# Altium schematic sheet LTC2194_4.SchDoc
size A; SheetNumber: 9; SheetTotal: 24
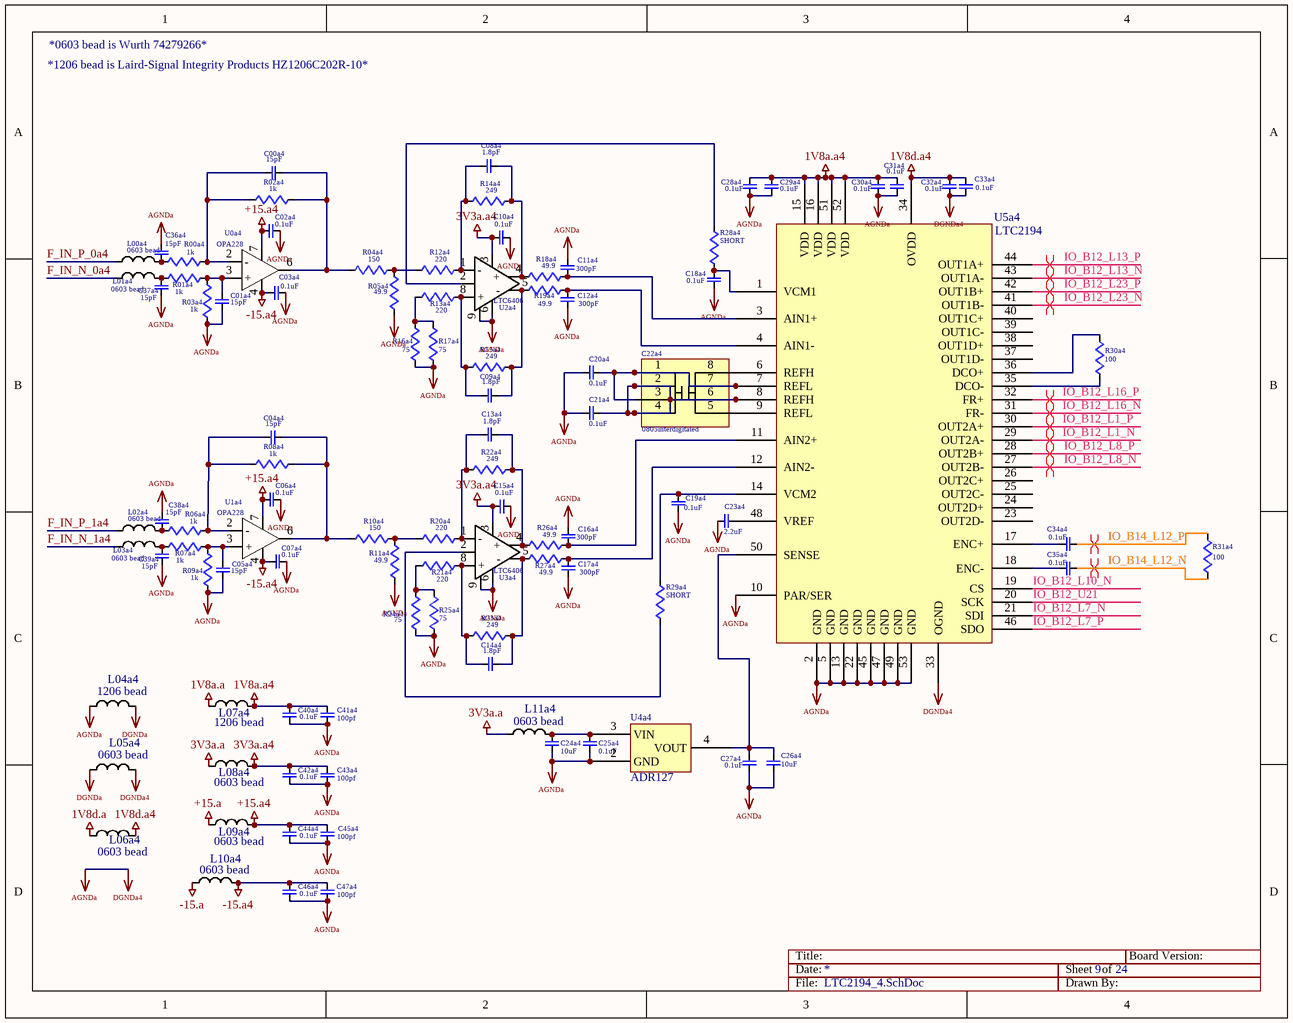
[diagram p0: LTC2194_4.SchDoc]

## Parts
C00a4  15pF  [0603]
C01a4  15pF  [0603]
C02a4  0.1uF  [0603]
C03a4  0.1uF  [0603]
C04a4  15pF  [0603]
C05a4  15pF  [0603]
C06a4  0.1uF  [0603]
C07a4  0.1uF  [0603]
C08a4  1.8pF  [0603]
C09a4  1.8pF  [0603]
C10a4  0.1uF  [0603]
C11a4  300pF  [0603]
C12a4  300pF  [0603]
C13a4  1.8pF  [0603]
C14a4  1.8pF  [0603]
C15a4  0.1uF  [0603]
C16a4  300pF  [0603]
C17a4  300pF  [0603]
C18a4  0.1uF  [0402]
C19a4  0.1uF  [0402]
C20a4  0.1uF  [0402]
C21a4  0.1uF  [0402]
C22a4  0805interdigitated  [0805int]
C23a4  2.2uF  [0402]
C24a4  10uF  [0603]
C25a4  0.1uF  [0603]
C26a4  10uF  [0603]
C27a4  0.1uF  [0603]
C28a4  0.1uF  [0402]
C29a4  0.1uF  [0402]
C30a4  0.1uF  [0402]
C31a4  0.1uF  [0402]
C32a4  0.1uF  [0402]
C33a4  0.1uF  [0402]
C34a4  0.1uF  [0402]
C35a4  0.1uF  [0402]
C36a4  15pF  [0603]
C37a4  15pF  [0603]
C38a4  15pF  [0603]
C39a4  15pF  [0603]
C40a4  0.1uF  [0603]
C41a4  100pf  [0603]
C42a4  0.1uF  [0603]
C43a4  100pf  [0603]
C44a4  0.1uF  [0603]
C45a4  100pf  [0603]
C46a4  0.1uF  [0603]
C47a4  100pf  [0603]
L00a4  0603 bead  [0603]
L01a4  0603 bead  [0603]
L02a4  0603 bead  [0603]
L03a4  0603 bead  [0603]
L04a4  1206 bead  [1206]
L05a4  0603 bead  [0603]
L06a4  0603 bead  [0603]
L07a4  1206 bead  [1206]
L08a4  0603 bead  [0603]
L09a4  0603 bead  [0603]
L10a4  0603 bead  [0603]
L11a4  0603 bead  [0603]
R00a4  1k  [0603]
R01a4  1k  [0603]
R02a4  1k  [0603]
R03a4  1k  [0603]
R04a4  150  [0603]
R05a4  49.9  [0603]
R06a4  1k  [0603]
R07a4  1k  [0603]
R08a4  1k  [0603]
R09a4  1k  [0603]
R10a4  150  [0603]
R11a4  49.9  [0603]
R12a4  220  [0603]
R13a4  220  [0603]
R14a4  249  [0603]
R15a4  249  [0603]
R16a4  75  [0603]
R17a4  75  [0603]
R18a4  49.9  [0603]
R19a4  49.9  [0603]
R20a4  220  [0603]
R21a4  220  [0603]
R22a4  249  [0603]
R23a4  249  [0603]
R24a4  75  [0603]
R25a4  75  [0603]
R26a4  49.9  [0603]
R27a4  49.9  [0603]
R28a4  SHORT  [0603]
R29a4  SHORT  [0603]
R30a4  100  [0603]
R31a4  100  [0402]
U0a4  OPA228  [8SOIC]
U1a4  OPA228  [8SOIC]
U2a4  LTC6406  [8MSOP]
U3a4  LTC6406  [8MSOP]
U4a4  ADR127  [6TSOT]
U5a4  LTC2194  [52QFN]

## Nets
1V8a.a: L07a4.1
1V8a.a4: C28a4.1 C29a4.1 C30a4.1 C31a4.1 C40a4.1 C41a4.1 L07a4.2 U5a4.15(VDD) U5a4.16(VDD) U5a4.51(VDD) U5a4.52(VDD)
1V8d.a: L06a4.1
1V8d.a4: C32a4.1 C33a4.2 L06a4.2 U5a4.34(OVDD)
3V3a.a: L08a4.1 L11a4.1
3V3a.a4: C10a4.1 C15a4.1 C42a4.1 C43a4.1 L08a4.2 U2a4.3(V+) U3a4.3(V+)
+15.a: L09a4.1
+15.a4: C02a4.2 C06a4.2 C44a4.1 C45a4.1 L09a4.2 U0a4.7(V+) U1a4.7(V+)
-15.a: L10a4.1
-15.a4: C03a4.2 C07a4.2 C46a4.1 C47a4.1 L10a4.2 U0a4.4(V-) U1a4.4(V-)
AGNDa: C01a4.2 C02a4.1 C03a4.1 C05a4.2 C06a4.1 C07a4.1 C10a4.2 C11a4.2 C12a4.1 C15a4.2 C16a4.2 C17a4.1 C18a4.1 C19a4.1 C20a4.2 C21a4.2 C23a4.2 C24a4.2 C25a4.2 C26a4.2 C27a4.2 C28a4.2 C29a4.2 C30a4.2 C31a4.2 C32a4.2 C33a4.1 C36a4.1 C37a4.2 C38a4.1 C39a4.2 C40a4.2 C41a4.2 C42a4.2 C43a4.2 C44a4.2 C45a4.2 C46a4.2 C47a4.2 L04a4.1 L05a4.2 R03a4.1 R05a4.2 R09a4.1 R11a4.2 R16a4.2 R17a4.2 R24a4.2 R25a4.2 U2a4.6(V-) U2a4.9(V-) U3a4.6(V-) U3a4.9(V-) U4a4.2(GND) U5a4.2(GND) U5a4.5(GND) U5a4.10(PAR/SER) U5a4.13(GND) U5a4.22(GND) U5a4.33(OGND) U5a4.45(GND) U5a4.47(GND) U5a4.49(GND) U5a4.53(GND)  [also labelled DGNDa4]
DGNDa: L04a4.2 L05a4.1
F_IN_N_0a4: L01a4.1
F_IN_N_1a4: L03a4.1
F_IN_P_0a4: L00a4.1
F_IN_P_1a4: L02a4.1
IO_B12_L1_N: U5a4.29(OUT2A-)
IO_B12_L1_P: U5a4.30(OUT2A+)
IO_B12_L7_N: U5a4.21(SDI)
IO_B12_L7_P: U5a4.46(SDO)
IO_B12_L8_N: U5a4.27(OUT2B-)
IO_B12_L8_P: U5a4.28(OUT2B+)
IO_B12_L10_N: U5a4.19(CS)
IO_B12_L13_N: U5a4.43(OUT1A-)
IO_B12_L13_P: U5a4.44(OUT1A+)
IO_B12_L16_N: U5a4.31(FR-)
IO_B12_L16_P: U5a4.32(FR+)
IO_B12_L23_N: U5a4.41(OUT1B-)
IO_B12_L23_P: U5a4.42(OUT1B+)
IO_B12_U21: U5a4.20(SCK)
IO_B14_L12_N: C35a4.1 R31a4.2
IO_B14_L12_P: C34a4.1 R31a4.1
NetC00a4_1: C00a4.1 R00a4.1 R02a4.2 U0a4.2(-)
NetC00a4_2: C00a4.2 R02a4.1 R04a4.2 U0a4.6(OUT)
NetC01a4_1: C01a4.1 R01a4.1 R03a4.2 U0a4.3(+)
NetC04a4_1: C04a4.1 R06a4.1 R08a4.2 U1a4.2(-)
NetC04a4_2: C04a4.2 R08a4.1 R10a4.2 U1a4.6(OUT)
NetC05a4_1: C05a4.1 R07a4.1 R09a4.2 U1a4.3(+)
NetC08a4_1: C08a4.1 R12a4.1 R14a4.2 U2a4.1(-)
NetC08a4_2: C08a4.2 R14a4.1 R18a4.2 U2a4.4(+)
NetC09a4_1: C09a4.1 R13a4.1 R15a4.2 U2a4.8(+)
NetC09a4_2: C09a4.2 R15a4.1 R19a4.2 U2a4.5(-)
NetC11a4_1: C11a4.1 R18a4.1 U5a4.3(AIN1+)
NetC12a4_2: C12a4.2 R19a4.1 U5a4.4(AIN1-)
NetC13a4_1: C13a4.1 R20a4.1 R22a4.2 U3a4.1(-)
NetC13a4_2: C13a4.2 R22a4.1 R26a4.2 U3a4.4(+)
NetC14a4_1: C14a4.1 R21a4.1 R23a4.2 U3a4.8(+)
NetC14a4_2: C14a4.2 R23a4.1 R27a4.2 U3a4.5(-)
NetC16a4_1: C16a4.1 R26a4.1 U5a4.11(AIN2+)
NetC17a4_2: C17a4.2 R27a4.1 U5a4.12(AIN2-)
NetC18a4_2: C18a4.2 R28a4.2 U5a4.1(VCM1)
NetC19a4_2: C19a4.2 R29a4.1 U5a4.14(VCM2)
NetC20a4_1: C20a4.1 C22a4.1 C22a4.3 C22a4.7 U5a4.7(REFL)
NetC21a4_1: C21a4.1 C22a4.2 C22a4.4 C22a4.6 U5a4.8(REFH)
NetC22a4_5: C22a4.5 U5a4.9(REFL)
NetC22a4_8: C22a4.8 U5a4.6(REFH)
NetC23a4_1: C23a4.1 U5a4.48(VREF)
NetC24a4_1: C24a4.1 C25a4.1 L11a4.2 U4a4.3(VIN)
NetC26a4_1: C26a4.1 C27a4.1 U4a4.4(VOUT) U5a4.50(SENSE)
NetC34a4_2: C34a4.2 U5a4.17(ENC+)
NetC35a4_2: C35a4.2 U5a4.18(ENC-)
NetC36a4_2: C36a4.2 L00a4.2 R00a4.2
NetC37a4_1: C37a4.1 L01a4.2 R01a4.2
NetC38a4_2: C38a4.2 L02a4.2 R06a4.2
NetC39a4_1: C39a4.1 L03a4.2 R07a4.2
NetR04a4_1: R04a4.1 R05a4.1 R12a4.2
NetR10a4_1: R10a4.1 R11a4.1 R20a4.2
NetR13a4_2: R13a4.2 R16a4.1 R17a4.1
NetR21a4_2: R21a4.2 R24a4.1 R25a4.1
NetR28a4_1: R28a4.1 U2a4.2(VOCM)
NetR29a4_2: R29a4.2 U3a4.2(VOCM)
NetR30a4_1: R30a4.1 U5a4.36(DCO+)
NetR30a4_2: R30a4.2 U5a4.35(DCO-)

Not connected (* = marked no-connect by the designer): U5a4 23(OUT2D-) 24(OUT2D+) 25(OUT2C-) 26(OUT2C+) 37(OUT1D-) 38(OUT1D+) 39(OUT1C-) 40(OUT1C+)

## Layout directives
differential pair: IO_B12_L1_N, IO_B12_L1_P, IO_B12_L8_N, IO_B12_L8_P, IO_B12_L13_N, IO_B12_L13_P, IO_B12_L16_N, IO_B12_L16_P, IO_B12_L23_N, IO_B12_L23_P, IO_B14_L12_N, IO_B14_L12_P

## Notes on the sheet
- *1206 bead is Laird-Signal Integrity Products HZ1206C202R-10*
- *0603 bead is Wurth 74279266*
- Title:
- Date:
- Sheet
- of
- Board Version:
- File:
- Drawn By:

## Library data of the parts
C00a4 C01a4 C02a4 C03a4 C04a4 C05a4 C06a4 C07a4 C08a4 C09a4 C10a4 C11a4 C12a4 C13a4 C14a4 C15a4 C16a4 C17a4 C18a4 C19a4 C20a4 C21a4 C23a4 C24a4 C25a4 C26a4 C27a4 C28a4 C29a4 C30a4 C31a4 C32a4 C33a4 C34a4 C35a4 C36a4 C37a4 C38a4 C39a4 C40a4 C41a4 C42a4 C43a4 C44a4 C45a4 C46a4 C47a4 = CAP
C22a4 = 0805intCap
L00a4 L01a4 L02a4 L03a4 L04a4 L05a4 L06a4 L07a4 L08a4 L09a4 L10a4 L11a4 = INDUCTOR
R00a4 R01a4 R02a4 R03a4 R04a4 R05a4 R06a4 R07a4 R08a4 R09a4 R10a4 R11a4 R12a4 R13a4 R14a4 R15a4 R16a4 R17a4 R18a4 R19a4 R20a4 R21a4 R22a4 R23a4 R24a4 R25a4 R26a4 R27a4 R28a4 R29a4 R30a4 R31a4 = RES
U0a4 U1a4 = LF356
U4a4 = ADR12x